# EAGLE schematic HL78xx-STM32U5 -V3 (EAGLE 9.5.2)
Assembly variants: Production

## Sheet 1 of 3
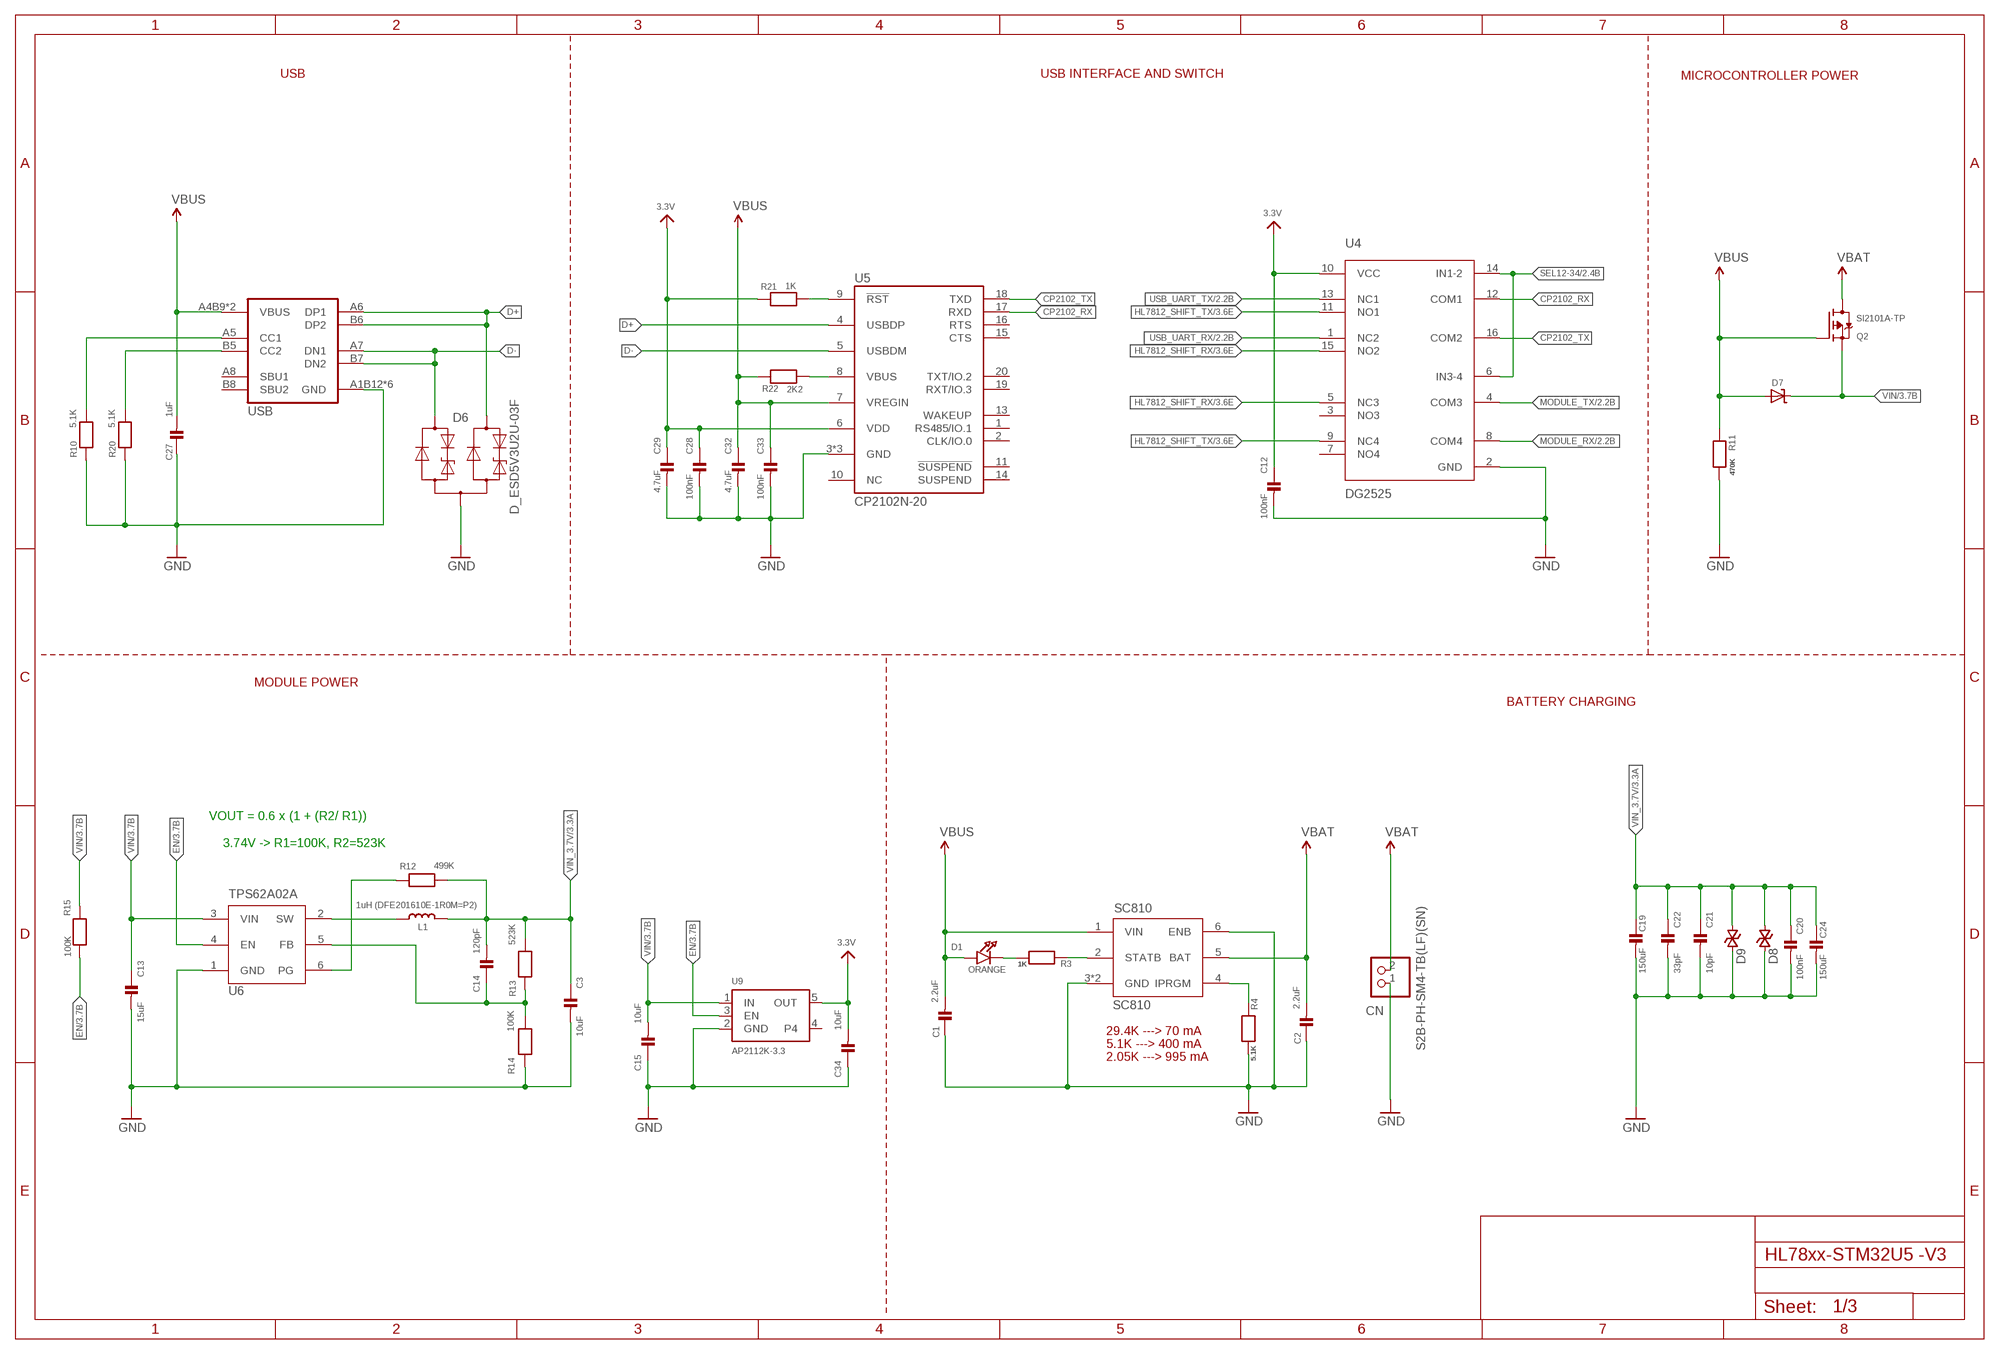
[diagram p0: schematic, sheet 1]

### Parts
C1  2.2uF  CAP_CERAMIC_0402  [_0402]
C2  2.2uF  CAP_CERAMIC_0402  [_0402]
C3  10uF  CAP_CERAMIC1206  [1206]
C12  100nF  CAP_CERAMIC_0402  [_0402]
C13  15uF  CAP_CERAMIC_0805  [_0805]
C14  120pF  CAP_CERAMIC0402  [0402]
C15  10uF  CAP_CERAMIC0603  [0603]
C19  150uF  CAP_CERAMIC-1210  [1210-C]
C20  100nF  CAP_CERAMIC_0402  [_0402]
C21  10pF  CAP_CERAMIC_0402  [_0402]
C22  33pF  CAP_CERAMIC_0402  [_0402]
C24  150uF  CAP_CERAMIC-1210  [1210-C]
C27  1uF  CAP_CERAMIC_0402  [_0402]
C28  100nF  CAP_CERAMIC_0402  [_0402]
C29  4.7uF  CAP_CERAMIC_0402  [_0402]
C32  4.7uF  CAP_CERAMIC_0402  [_0402]
C33  100nF  CAP_CERAMIC_0402  [_0402]
C34  10uF  CAP_CERAMIC0603  [0603]
CN  S2B-PH-SM4-TB(LF)(SN)  JST_2PIN  [JSTPH2]
D1  ORANGE  LED0603  [CHIPLED_0603]
D6  D_ESD5V3U2U-03F  [SOT723]
D7  DIODE-SCHOTTKYSOD-123  [SOD-123]
D8  CGA0402MLC-05G  ESD-0402-0402_ESD  [_0402_ESD]
D9  CGA0402MLC-05G  ESD-0402-0402_ESD  [_0402_ESD]
L1  1uH (DFE201610E-1R0M=P2)  INDUCTOR-0806  [0806-IND]
Q2  SI2101A-TP  MOSFET-P  [SOT23-3]
R3  1K  RESISTOR_0402  [0402-R]
R4  5.1K  RESISTOR_0402  [0402-R]
R10  5.1K  RESISTOR_0402  [0402-R]
R11  470K  RESISTOR_0402  [0402-R]
R12  499K  RESISTOR0603  [0603]
R13  523K  RESISTOR_0603  [_0603-R]
R14  100K  RESISTOR0402  [0402]
R15  100K  RESISTOR0402  [0402]
R20  5.1K  RESISTOR_0402  [0402-R]
R21  1K  RESISTOR_0402  [0402-R]
R22  2K2  RESISTOR_0402  [0402-R]
U1  SC810  [MLPD-UT62X2]
U4  DG2525  [QFN-16L]
U5  CP2102N-20  [QFN20]
U6  TPS62A02A  TPS62A0XA  [SOT-563]
U9  AP2112K-3.3  VREG_SOT23-5  [SOT23-5@1]
USB  USB-4110-CGT  [USB4105-CGT]

### Nets
3.3V: C12.1 C28.1 C29.1 C34.2 R21.2 U4.10(VCC) U5.6(VDD) U9.5(OUT) ; also sheet 2,3
CC1: R10.1 USB.A5(CC1)
CC2: R20.1 USB.B5(CC2)
CP2102_RX: U4.12(COM1) U5.17(RXD)
CP2102_TX: U4.16(COM2) U5.18(TXD)
D+: D6.2(C2) U5.4(USBDP) USB.A6(DP1) USB.B6(DP2)
D-: D6.1(C1) U5.5(USBDM) USB.A7(DN1) USB.B7(DN2)
EN: R15.2 U6.4(EN) U9.3(EN) ; also sheet 3
GND: C1.1 C2.1 C3.2 C12.2 C13.2 C15.1 C19.2 C20.2 C21.2 C22.2 C24.2 C27.1 C28.2 C29.2 C32.2 C33.2 C34.1 CN.1 D6.3(A) D8.1(A) D9.1(A) R4.1 R10.2 R11.1 R14.1 R20.2 U1.3(GND) U1.6(ENB) U1.THERMAL(GND) U4.2(GND) U5.3(GND) U5.12(GND) U5.TP(GND) U6.1(GND) U9.2(GND) USB.A1B12(GND) USB.B1A12(GND) USB.N0(GND) USB.N1(GND) USB.N2(GND) USB.N3(GND) ; also sheet 2,3
HL7812_SHIFT_RX: U4.5(NC3) U4.15(NO2) ; also sheet 3
HL7812_SHIFT_TX: U4.9(NC4) U4.11(NO1) ; also sheet 3
MODULE_RX: U4.8(COM4) ; also sheet 2
MODULE_TX: U4.4(COM3) ; also sheet 2
N$1: D1.C R3.1
N$3: C14.1 R13.1 R14.2 U6.5(FB)
N$5: R12.1 U6.6(PG)
N$8: L1.1 U6.2(SW)
N$28: R22.1 U5.8(VBUS)
N$48: R3.2 U1.2(STATB)
N$51: R4.2 U1.4(IPRGM)
RESET: R21.1 U5.9(!RST)
SEL12-34: U4.6(IN3-4) U4.14(IN1-2) ; also sheet 2
USB_UART_RX: U4.1(NC2) ; also sheet 2
USB_UART_TX: U4.13(NC1) ; also sheet 2
VBAT: C2.2 CN.2 Q2.3(D) U1.5(BAT) ; also sheet 3
VBUS: C1.2 C27.2 C32.1 C33.1 D1.A D7.A Q2.1(G) R11.2 R22.2 U1.1(VIN) U5.7(VREGIN) USB.A4B9(VBUS) USB.B4A9(VBUS) ; also sheet 3
VIN: C13.1 C15.2 D7.C Q2.2(S) R15.1 U6.3(VIN) U9.1(IN) ; also sheet 3
VIN_3.7V: C3.1 C14.2 C19.1 C20.1 C21.1 C22.1 C24.1 D8.2(C) D9.2(C) L1.2 R12.2 R13.2 ; also sheet 3
Unconnected: U4.3(NO3) U4.7(NO4) U5.1(RS485/IO.1) U5.2(CLK/IO.0) U5.11(!SUSPEND) U5.13(WAKEUP) U5.14(SUSPEND) U5.15(CTS) U5.16(RTS) U5.19(RXT/IO.3) U5.20(TXT/IO.2) U9.4 USB.A8(SBU1) USB.B8(SBU2)

### Notes on the sheet
- USB | USB INTERFACE AND SWITCH
- MICROCONTROLLER POWER
- MODULE POWER
- BATTERY CHARGING
- VOUT = 0.6 x (1 + (R2/ R1))
       
      3.74V -> R1=100K, R2=523K
- 29.4K ---> 70 mA
- 5.1K ---> 400 mA
- 2.05K ---> 995 mA

## Sheet 2 of 3
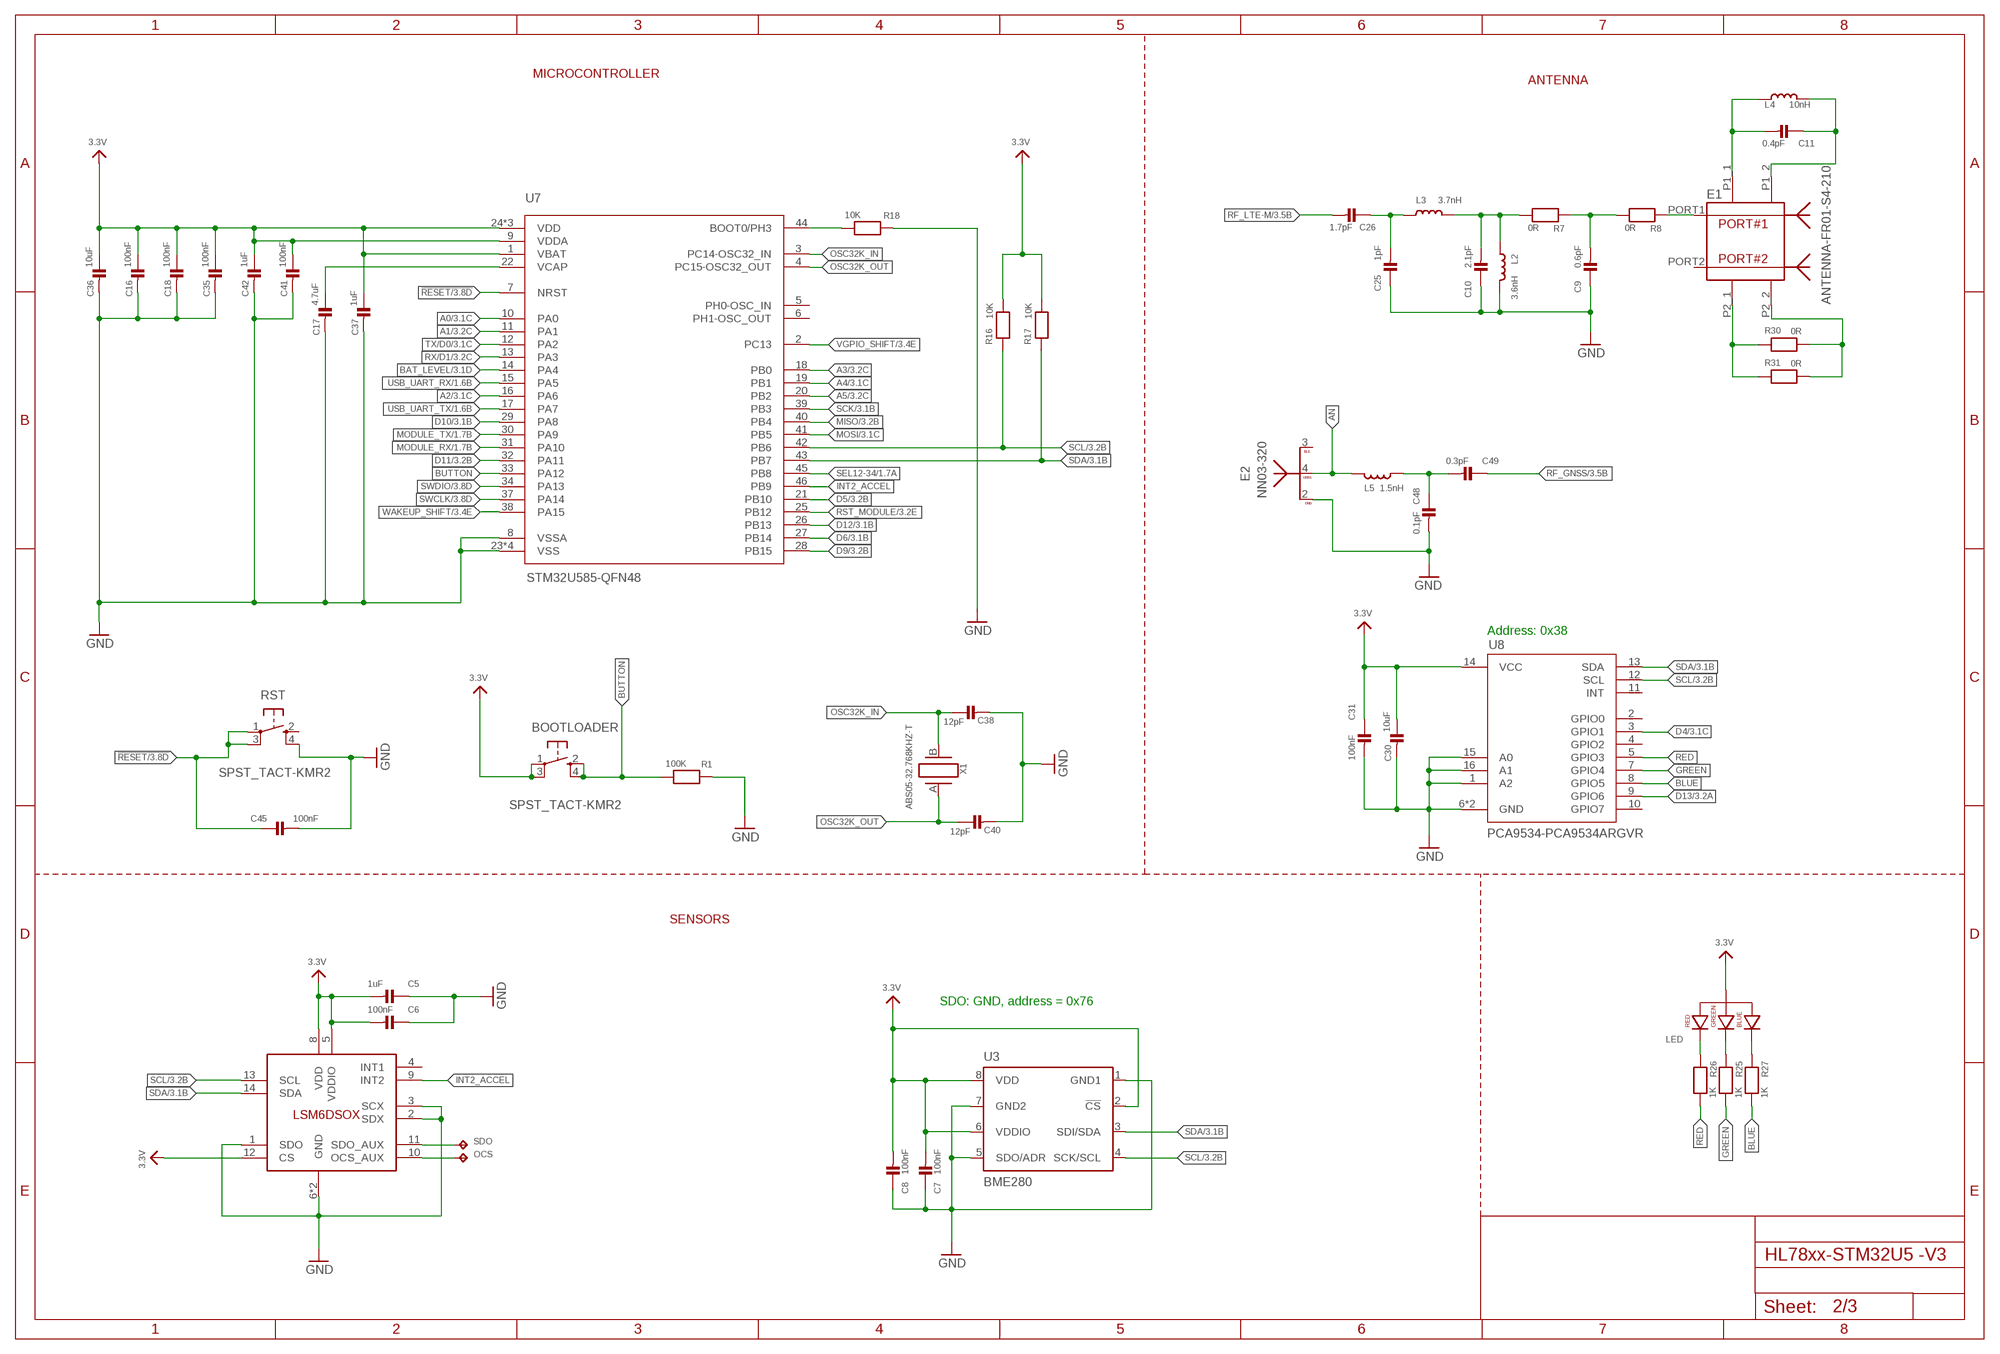
[diagram p1: schematic, sheet 2]

### Parts
BOOTLOADER  SPST_TACT-KMR2  [KMR2]
C5  1uF  CAP_CERAMIC_0402  [_0402]
C6  100nF  CAP_CERAMIC_0402  [_0402]
C7  100nF  CAP_CERAMIC_0402  [_0402]
C8  100nF  CAP_CERAMIC_0402  [_0402]
C9  0.6pF  CAP_CERAMIC_1MMX1MM  [C_1MMX1MM-IGNION]
C10  2.1pF  CAP_CERAMIC_1MMX1MM  [C_1MMX1MM-IGNION]
C11  0.4pF  CAP_CERAMIC-1MMX0.75MM-IGNION  [C_1MMX0.75MM-IGNION]
C16  100nF  CAP_CERAMIC_0402  [_0402]
C17  4.7uF  CAP_CERAMIC_0402  [_0402]
C18  100nF  CAP_CERAMIC_0402  [_0402]
C25  1pF  CAP_CERAMIC_1MMX1MM  [C_1MMX1MM-IGNION]
C26  1.7pF  CAP_CERAMIC_1MMX1MM  [C_1MMX1MM-IGNION]
C30  10uF  CAP_CERAMIC_0402  [_0402]
C31  100nF  CAP_CERAMIC_0402  [_0402]
C35  100nF  CAP_CERAMIC_0402  [_0402]
C36  10uF  CAP_CERAMIC_0402  [_0402]
C37  1uF  CAP_CERAMIC_0402  [_0402]
C38  12pF  CAP_CERAMIC_0402  [_0402]
C40  12pF  CAP_CERAMIC_0402  [_0402]
C41  100nF  CAP_CERAMIC_0402  [_0402]
C42  1uF  CAP_CERAMIC_0402  [_0402]
C45  100nF  CAP_CERAMIC_0402  [_0402]
C48  0.1pF  CAP_CERAMIC_1MMX1MM  [C_1MMX1MM-IGNION]
C49  0.3pF  CAP_CERAMIC_1MMX1MM  [C_1MMX1MM-IGNION]
E1  ANTENNA-FR01-S4-210  [XDCR_FR01-S4-210]
E2  NN03-320  [XCVR_NN03-320]
L2  3.6nH  INDUCTOR_1MMX1MM-IGNION  [L_1MMX1MM-IGNION]
L3  3.7nH  INDUCTOR_1MMX1MM-IGNION  [L_1MMX1MM-IGNION]
L4  10nH  INDUCTOR-L_1MMX0.75MM-IGNION  [L_1MMX0.75MM-IGNION]
L5  1.5nH  INDUCTOR_1MMX1MM-IGNION  [L_1MMX1MM-IGNION]
LED  LED-RGB-ANODE-3.5X2.8-WURTH-150044M155260  [LED-WURTH-150044M155260]
OCS  TP-1SIDE-1P0  [TP-1P0]
R1  100K  RESISTOR_0402  [0402-R]
R7  0R  RESISTOR_1MMX1MM  [R_1MMX1MM-IGNION]
R8  0R  RESISTOR_1MMX1MM  [R_1MMX1MM-IGNION]
R16  10K  RESISTOR_0402  [0402-R]
R17  10K  RESISTOR_0402  [0402-R]
R18  10K  RESISTOR_0402  [0402-R]
R25  1K  RESISTOR_0402  [0402-R]
R26  1K  RESISTOR_0402  [0402-R]
R27  1K  RESISTOR_0402  [0402-R]
R30  0R  RESISTOR-1MMX0.75MM-IGNION  [R_1MMX0.75MM-IGNION]
R31  0R  RESISTOR-1MMX0.75MM-IGNION  [R_1MMX0.75MM-IGNION]
RST  SPST_TACT-KMR2  [KMR2]
SDO  TP-1SIDE-1P0  [TP-1P0]
U2  LSM6DSOX  [LGA-14L]
U3  BME280  [BME280_LGA]
U7  STM32U585-QFN48  [TQFN48_7MM]
U8  PCA9534-PCA9534ARGVR  [QFN16-4X4MM]
X1  ABS05-32.768KHZ-T  ABS05-32.768KHZ-9-T  [ABS05]

### Nets
3.3V: BOOTLOADER.1(P) BOOTLOADER.3(P1) C5.2 C6.2 C7.2 C8.2 C16.1 C18.1 C30.1 C31.1 C35.1 C36.1 C37.1 C41.1 C42.1 LED.1(ANODE) R16.2 R17.2 U2.5(VDDIO) U2.8(VDD) U2.12(CS) U3.2(!CS) U3.6(VDDIO) U3.8(VDD) U7.1(VBAT) U7.9(VDDA) U7.24(VDD) U7.36(VDD) U7.48(VDD) U8.14(VCC) ; also sheet 1,3
!RESET: C45.1 RST.1(P) RST.3(P1) U7.7(NRST) ; also sheet 3
A0: U7.10(PA0) ; also sheet 3
A1: U7.11(PA1) ; also sheet 3
A2: U7.16(PA6) ; also sheet 3
A3: U7.18(PB0) ; also sheet 3
A4: U7.19(PB1) ; also sheet 3
A5: U7.20(PB2) ; also sheet 3
AN: E2.4(FEED_GNSS) L5.1
BAT_LEVEL: U7.14(PA4) ; also sheet 3
BLUE: R27.2 U8.8(GPIO5)
BOOT: R18.2 U7.44(BOOT0/PH3)
BUTTON: BOOTLOADER.2(S) BOOTLOADER.4(S1) R1.2 U7.33(PA12)
D4: U8.3(GPIO1) ; also sheet 3
D5: U7.21(PB10) ; also sheet 3
D6: U7.27(PB14) ; also sheet 3
D9: U7.28(PB15) ; also sheet 3
D10: U7.29(PA8) ; also sheet 3
D11: U7.32(PA11) ; also sheet 3
D12: U7.26(PB13) ; also sheet 3
D13: U8.9(GPIO6) ; also sheet 3
GND: C5.1 C6.1 C7.1 C8.1 C9.1 C10.1 C16.2 C17.2 C18.2 C25.1 C30.2 C31.2 C35.2 C36.2 C37.2 C38.2 C40.2 C41.2 C42.2 C45.2 C48.2 E2.2(GROUND) L2.2 R1.1 R18.1 RST.4(S1) U2.1(SDO) U2.2(SDX) U2.3(SCX) U2.6(GND) U2.7(GND) U3.1(GND1) U3.5(SDO/ADR) U3.7(GND2) U7.8(VSSA) U7.23(VSS) U7.35(VSS) U7.47(VSS) U7.THERMAL(VSS) U8.1(A2) U8.6(GND) U8.15(A0) U8.16(A1) U8.T(GND) ; also sheet 1,3
GREEN: R25.2 U8.7(GPIO4)
INT2_ACCEL: U2.9(INT2) U7.46(PB9)
MISO: U7.40(PB4) ; also sheet 3
MODULE_RX: U7.31(PA10) ; also sheet 1
MODULE_TX: U7.30(PA9) ; also sheet 1
MOSI: U7.41(PB5) ; also sheet 3
N$4: C17.1 U7.22(VCAP)
N$19: LED.4(BLUE_CATHODE) R27.1
N$20: C48.1 C49.2 L5.2
N$21: E1.PORT1(PORT#1) R8.1
N$22: C10.2 L2.1 L3.2 R7.2
N$23: C9.2 R7.1 R8.2
N$24: C25.2 C26.1 L3.1
N$25: C11.2 E1.P1_1(SECTION1_1) L4.1
N$26: C11.1 E1.P1_2(SECTION1_2) L4.2
N$27: LED.3(GREEN_CATHODE) R25.1
N$29: E1.P2_1(SECTION2_1) R30.1 R31.1
N$30: LED.2(RED_CATHODE) R26.1
N$31: E1.P2_2(SECTION2_2) R30.2 R31.2
OCS_AUX: OCS.TP U2.10(OCS_AUX)
OSC32K_IN: C38.1 U7.3(PC14-OSC32_IN) X1.B
OSC32K_OUT: C40.1 U7.4(PC15-OSC32_OUT) X1.A
RED: R26.2 U8.5(GPIO3)
RF_GNSS: C49.1 ; also sheet 3
RF_LTE-M: C26.2 ; also sheet 3
RST_MODULE: U7.25(PB12) ; also sheet 3
RX/D1: U7.13(PA3) ; also sheet 3
SCK: U7.39(PB3) ; also sheet 3
SCL: R16.1 U2.13(SCL) U3.4(SCK/SCL) U7.42(PB6) U8.12(SCL) ; also sheet 3
SDA: R17.1 U2.14(SDA) U3.3(SDI/SDA) U7.43(PB7) U8.13(SDA) ; also sheet 3
SDO_AUX: SDO.TP U2.11(SDO_AUX)
SEL12-34: U7.45(PB8) ; also sheet 1
SWCLK: U7.37(PA14) ; also sheet 3
SWDIO: U7.34(PA13) ; also sheet 3
TX/D0: U7.12(PA2) ; also sheet 3
USB_UART_RX: U7.15(PA5) ; also sheet 1
USB_UART_TX: U7.17(PA7) ; also sheet 1
VGPIO_SHIFT: U7.2(PC13) ; also sheet 3
WAKEUP_SHIFT: U7.38(PA15) ; also sheet 3
Unconnected: E1.PORT2(PORT#2) E2.3(FEED_BLUETOOTH) RST.2(S) U2.4(INT1) U7.5(PH0-OSC_IN) U7.6(PH1-OSC_OUT) U8.2(GPIO0) U8.4(GPIO2) U8.10(GPIO7) U8.11(INT)

### Notes on the sheet
- MICROCONTROLLER
- ANTENNA
- Address: 0x38
- SENSORS
- SDO: GND, address = 0x76

## Sheet 3 of 3
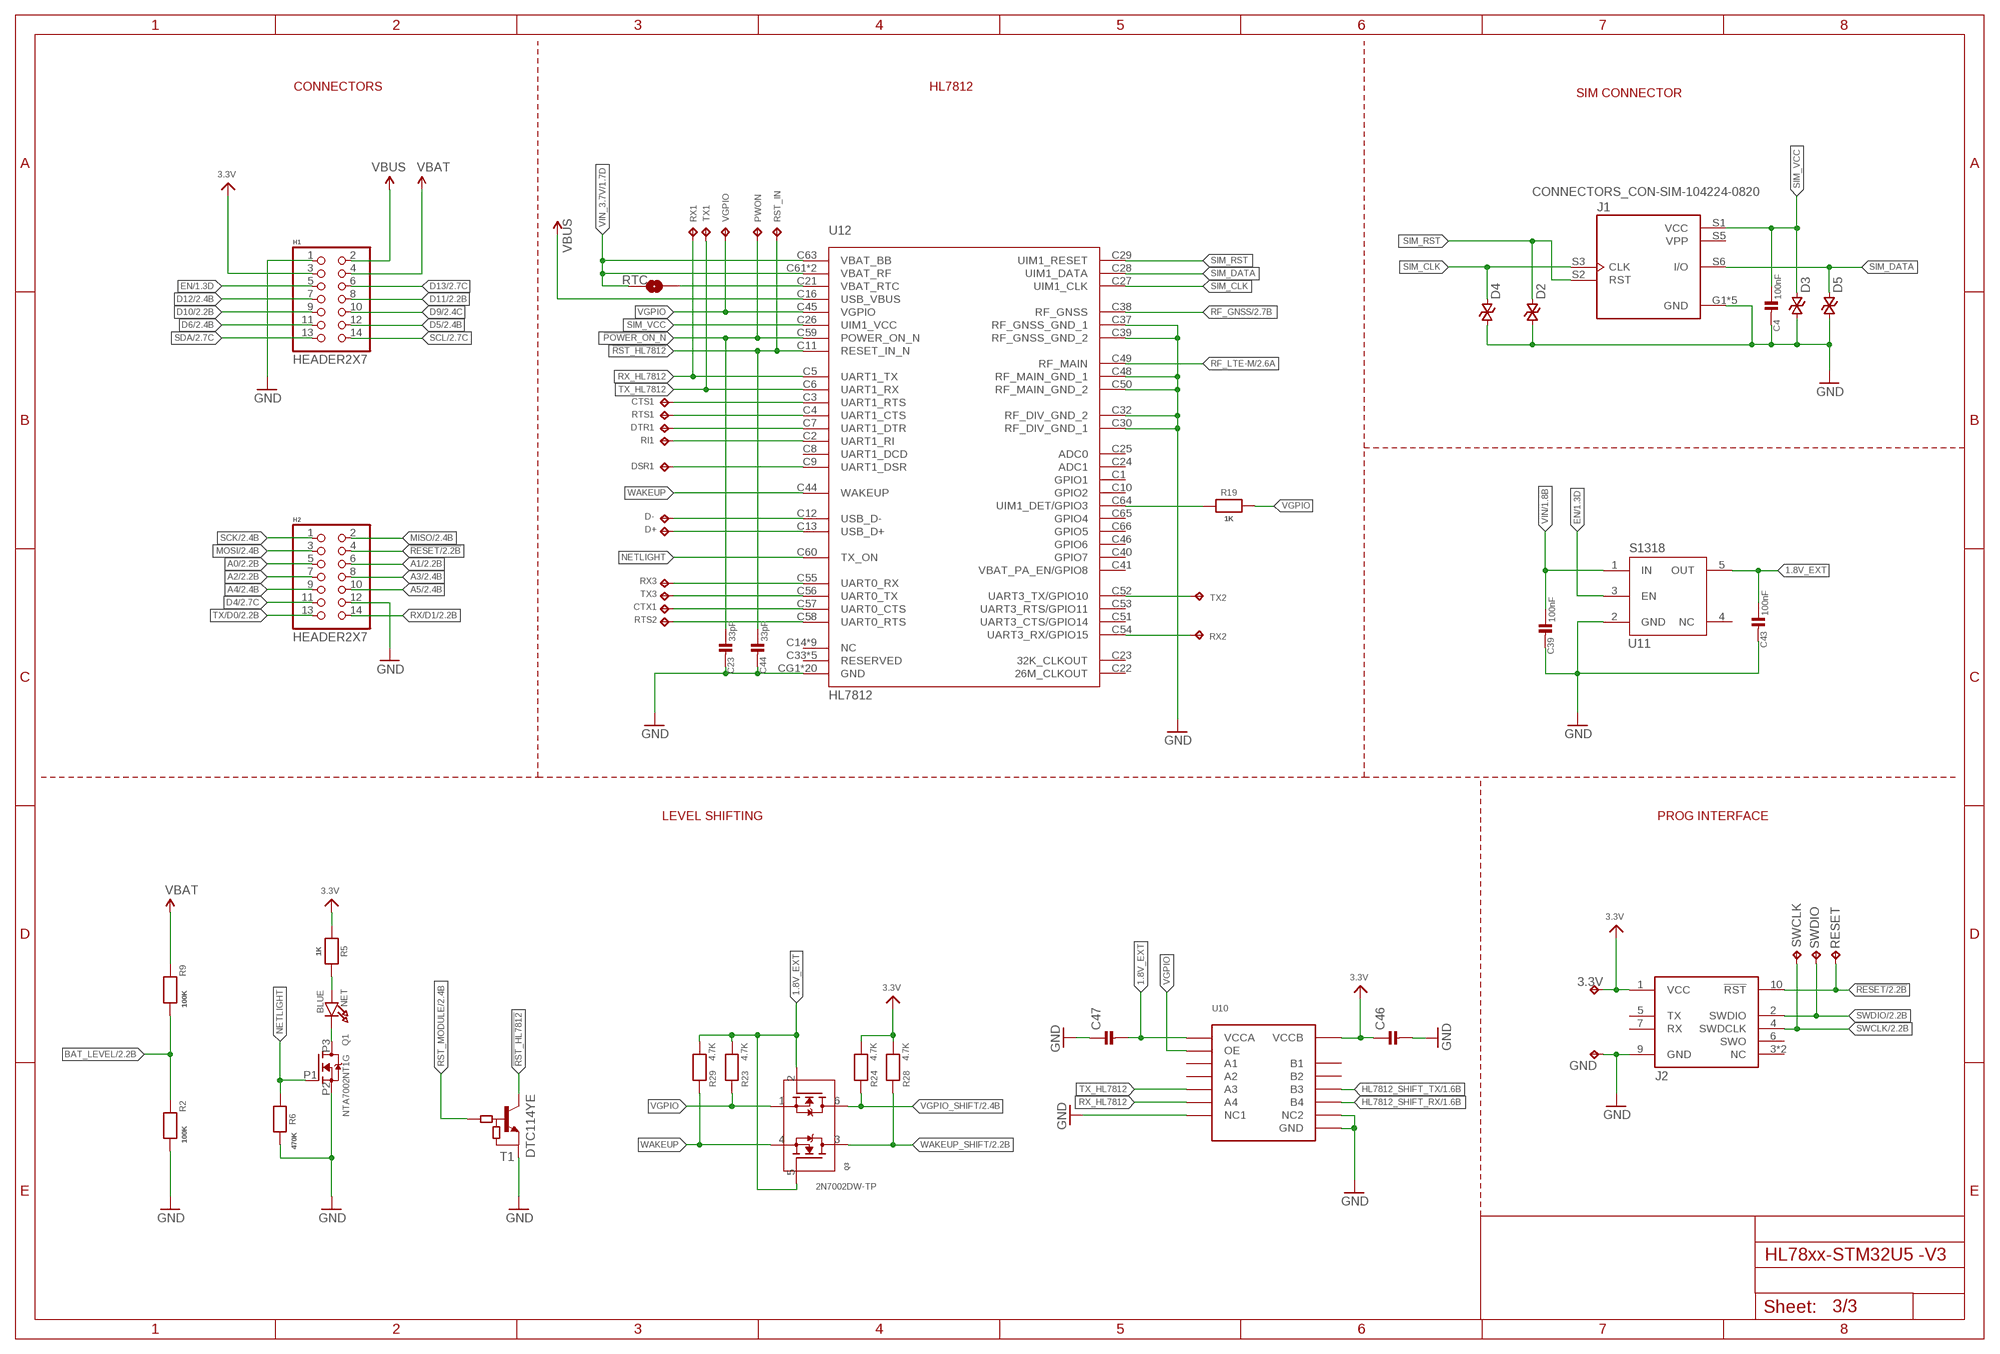
[diagram p2: schematic, sheet 3]

### Parts
3.3V  TP-1SIDE-1P0  [TP-1P0]
C4  100nF  CAP_CERAMIC_0402  [_0402]
C23  33pF  CAP_CERAMIC_0402  [_0402]
C39  100nF  CAP_CERAMIC_0402  [_0402]
C43  100nF  CAP_CERAMIC_0402  [_0402]
C44  33pF  CAP_CERAMIC_0402  [_0402]
C46  100nF  CAP_CERAMIC_0402  [_0402]
C47  100nF  CAP_CERAMIC_0402  [_0402]
CTS1  TP-1SIDE-1P0  [TP-1P0]
CTX1  TP-1SIDE-1P0  [TP-1P0]
D2  CGA0402MLC-05G  ESD-0402-0402_ESD  [_0402_ESD]
D3  CGA0402MLC-05G  ESD-0402-0402_ESD  [_0402_ESD]
D4  CGA0402MLC-05G  ESD-0402-0402_ESD  [_0402_ESD]
D5  CGA0402MLC-05G  ESD-0402-0402_ESD  [_0402_ESD]
D+  TP-1SIDE-1P0  [TP-1P0]
D-  TP-1SIDE-1P0  [TP-1P0]
DSR1  TP-1SIDE-1P0  [TP-1P0]
DTR1  TP-1SIDE-1P0  [TP-1P0]
GND  TP-1SIDE-1P0  [TP-1P0]
H1  HEADER2X7  [2X7-HEADER]
H2  HEADER2X7  [2X7-HEADER]
J1  CONNECTORS_CON-SIM-104224-0820  [CONNECTORS_MOLEX_104224-0820]
J2  CON-FTSH-105-XX-X-DV  [SAMTEC_FTSH-105-XX-X-DV]
NET  BLUE  LED0603  [CHIPLED_0603]
PWON  TP-1SIDE-1P0  [TP-1P0]
Q1  NTA7002NT1G  MOSFET-N-SC75  [SC-75/SOT-416]
Q3  2N7002DW-TP  MOSFET-N-DUAL  [SOT363]
R2  100K  RESISTOR_0402  [0402-R]
R5  1K  RESISTOR_0402  [0402-R]
R6  470K  RESISTOR_0402  [0402-R]
R9  100K  RESISTOR_0402  [0402-R]
R19  1K  RESISTOR_0402  [0402-R]
R23  4.7K  RESISTOR_0402  [0402-R]
R24  4.7K  RESISTOR_0402  [0402-R]
R28  4.7K  RESISTOR_0402  [0402-R]
R29  4.7K  RESISTOR_0402  [0402-R]
RESET  TP-1SIDE-1P0  [TP-1P0]
RI1  TP-1SIDE-1P0  [TP-1P0]
RST_IN  TP-1SIDE-1P0  [TP-1P0]
RTC  JUMPER-SMT_2_NC_PASTE_SILK  [SMT-JUMPER_2_NC_PASTE_SILK]
RTS1  TP-1SIDE-1P0  [TP-1P0]
RTS2  TP-1SIDE-1P0  [TP-1P0]
RX1  TP-1SIDE-1P0  [TP-1P0]
RX2  TP-1SIDE-1P0  [TP-1P0]
RX3  TP-1SIDE-1P0  [TP-1P0]
SWCLK  TP-1SIDE-1P0  [TP-1P0]
SWDIO  TP-1SIDE-1P0  [TP-1P0]
T1  DTC114YE  [SC-75/SOT-416]
TX1  TP-1SIDE-1P0  [TP-1P0]
TX2  TP-1SIDE-1P0  [TP-1P0]
TX3  TP-1SIDE-1P0  [TP-1P0]
U10  TXB0104  [PVQFN-N14]
U11  S1318  [SOT23-5]
U12  HL7812  HL781X  [HL781X]
VGPIO  TP-1SIDE-1P0  [TP-1P0]

### Nets
1.8V_EXT: C43.1 C47.2 Q3.2(G1) Q3.5(G2) R23.2 R29.2 U10.1(VCCA) U11.5(OUT)
3.3V: 3.3V.TP C46.1 H1.3 J2.1(VCC) R5.1 R24.2 R28.2 U10.14(VCCB) ; also sheet 1,2
!POWER_ON_N: C23.1 PWON.TP U12.C59(POWER_ON_N)
!RESET: H2.4 J2.10(!RST) RESET.TP ; also sheet 2
!RST_HL7812: C44.1 RST_IN.TP T1.P3(C) U12.C11(RESET_IN_N)
A0: H2.5 ; also sheet 2
A1: H2.6 ; also sheet 2
A2: H2.7 ; also sheet 2
A3: H2.8 ; also sheet 2
A4: H2.9 ; also sheet 2
A5: H2.10 ; also sheet 2
BAT_LEVEL: R2.1 R9.2 ; also sheet 2
CTS_HL7812: CTS1.TP U12.C3(UART1_RTS)
D4: H2.11 ; also sheet 2
D5: H1.12 ; also sheet 2
D6: H1.11 ; also sheet 2
D9: H1.10 ; also sheet 2
D10: H1.9 ; also sheet 2
D11: H1.8 ; also sheet 2
D12: H1.7 ; also sheet 2
D13: H1.6 ; also sheet 2
EN: H1.5 U11.3(EN) ; also sheet 1
GND: C4.2 C23.2 C39.2 C43.2 C44.2 C46.2 C47.1 D2.1(A) D3.1(A) D4.1(A) D5.1(A) GND.TP H1.1 H2.12 J1.G1(GND) J1.G2(GND) J1.G3(GND) J1.G4(GND) J1.S4(GND) J2.9(GND) Q1.P2(S) R2.2 R6.2 T1.P2(E) U10.6(NC1) U10.7(GND) U10.9(NC2) U10.GND U11.2(GND) U12.C30(RF_DIV_GND_1) U12.C32(RF_DIV_GND_2) U12.C37(RF_GNSS_GND_1) U12.C39(RF_GNSS_GND_2) U12.C48(RF_MAIN_GND_1) U12.C50(RF_MAIN_GND_2) U12.CG1(GND) U12.CG2(GND) U12.CG3(GND) U12.CG4(GND) U12.G1(GND) U12.G2(GND) U12.G3(GND) U12.G4(GND) U12.G5(GND) U12.G6(GND) U12.G7(GND) U12.G8(GND) U12.G9(GND) U12.G10(GND) U12.G11(GND) U12.G12(GND) U12.G13(GND) U12.G14(GND) U12.G15(GND) U12.G16(GND) ; also sheet 1,2
HL7812_SHIFT_RX: U10.10(B4) ; also sheet 1
HL7812_SHIFT_TX: U10.11(B3) ; also sheet 1
HL_D+: D-.TP U12.C12(USB_D-)
HL_D-: D+.TP U12.C13(USB_D+)
MISO: H2.2 ; also sheet 2
MOSI: H2.3 ; also sheet 2
N$7: NET.C Q1.P3(D)
N$9: NET.A R5.2
N$12: RX2.TP U12.C54(UART3_RX/GPIO15)
N$14: TX2.TP U12.C52(UART3_TX/GPIO10)
N$15: RX3.TP U12.C55(UART0_RX)
N$16: TX3.TP U12.C56(UART0_TX)
N$17: CTX1.TP U12.C57(UART0_CTS)
N$18: RTS2.TP U12.C58(UART0_RTS)
N$32: RI1.TP U12.C2(UART1_RI)
N$33: DTR1.TP U12.C7(UART1_DTR)
N$34: DSR1.TP U12.C9(UART1_DSR)
N$37: RTC.2 U12.C21(VBAT_RTC)
NETLIGHT: Q1.P1(G) R6.1 U12.C60(TX_ON)
RF_GNSS: U12.C38(RF_GNSS) ; also sheet 2
RF_LTE-M: U12.C49(RF_MAIN) ; also sheet 2
RST_MODULE: T1.P1(B) ; also sheet 2
RTS_HL7812: RTS1.TP U12.C4(UART1_CTS)
RX/D1: H2.14 ; also sheet 2
RX_HL7812: RX1.TP U10.5(A4) U12.C5(UART1_TX)
SCK: H2.1 ; also sheet 2
SCL: H1.14 ; also sheet 2
SDA: H1.13 ; also sheet 2
SIM_CLK: D4.2(C) J1.S3(CLK) U12.C27(UIM1_CLK)
SIM_DATA: D5.2(C) J1.S6(I/O) U12.C28(UIM1_DATA)
SIM_RST: D2.2(C) J1.S2(RST) U12.C29(UIM1_RESET)
SIM_VCC: C4.1 D3.2(C) J1.S1(VCC) U12.C26(UIM1_VCC)
SWCLK: J2.4(SWDCLK) SWCLK.TP ; also sheet 2
SWDIO: J2.2(SWDIO) SWDIO.TP ; also sheet 2
TX/D0: H2.13 ; also sheet 2
TX_HL7812: TX1.TP U10.4(A3) U12.C6(UART1_RX)
UIM1_DET: R19.1 U12.C64(UIM1_DET/GPIO3)
VBAT: H1.4 R9.1 ; also sheet 1
VBUS: H1.2 U12.C16(USB_VBUS) ; also sheet 1
VGPIO: Q3.1(S1) R19.2 R23.1 U10.8(OE) U12.C45(VGPIO) VGPIO.TP
VGPIO_SHIFT: Q3.6(D1) R24.1 ; also sheet 2
VIN: C39.1 U11.1(IN) ; also sheet 1
VIN_3.7V: RTC.1 U12.C61(VBAT_RF) U12.C62(VBAT_RF) U12.C63(VBAT_BB) ; also sheet 1
WAKEUP: Q3.4(S2) R29.1 U12.C44(WAKEUP)
WAKEUP_SHIFT: Q3.3(D2) R28.1 ; also sheet 2
Unconnected: J2.3(NC) J2.5(TX) J2.6(SWO) J2.7(RX) J2.8(NC) U10.2(A1) U10.3(A2) U10.12(B2) U10.13(B1) U11.4(NC) U12.C1(GPIO1) U12.C8(UART1_DCD) U12.C10(GPIO2) U12.C14(NC) U12.C15(NC) U12.C17(NC) U12.C18(NC) U12.C19(NC) U12.C20(NC) U12.C22(26M_CLKOUT) U12.C23(32K_CLKOUT) U12.C24(ADC1) U12.C25(ADC0) U12.C31(NC) U12.C33(RESERVED) U12.C34(RESERVED) U12.C35(RESERVED) U12.C36(RESERVED) U12.C40(GPIO7) U12.C41(VBAT_PA_EN/GPIO8) U12.C42(NC) U12.C43(RESERVED) U12.C46(GPIO6) U12.C47(NC) U12.C51(UART3_CTS/GPIO14) U12.C53(UART3_RTS/GPIO11) U12.C65(GPIO4) U12.C66(GPIO5)

### Notes on the sheet
- CONNECTORS | HL7812
- SIM CONNECTOR
- LEVEL SHIFTING | PROG INTERFACE

## Power pins joined to a net without a drawn wire
NC: U5.10(NC)
VPP: J1.S5(VPP)

## Library data of the parts
3.3V CTS1 CTX1 D+ D- DSR1 DTR1 GND OCS PWON RESET RI1 RST_IN RTS1 RTS2 RX1-RX3 SDO SWCLK SWDIO TX1-TX3 VGPIO = tobias:TP: TEST POINT
BOOTLOADER RST = tobias:SPST_TACT: SMT 6mm switch, EVQQ2 series http://www.ladyada.net/library/eagle
C1-C49 = tobias:CAP_CERAMIC: Ceramic Capacitors 0402 - 0402 Surface Mount Capacitors 16pF 50V 5% [Digikey: 445-4899-2-ND] 18pF 50V 5% [Digikey: 490-1281-2-ND] 22pF 50V 5% [Digikey: 490-1283-2-ND] 68pF 50V 5% [Digikey: 490-1289-2-ND] 0.1uF 10V 10% [Digikey: 490-1318-2-ND] 1.0uF 6.3V 10% [Digikey: 490-1320-2-ND] 0603 - 0603 Surface Mount Capacitors 16 pF 50V 5% [Digikey: 445-5051-2-ND] 22 pF 50V [Digikey: PCC220ACVTR-ND] 33 pF 50V 5% [Digikey: 490-1415-1-ND] 56pF 50V 5% [Digikey: 490-1421-1-ND] 220pF 50V 5% [Digikey: 445-1285-1-ND] 680 pF 50V 2200 pF 50V 5% C0G [Digikey: 445-1297-1-ND] 5600 pF 100V 5% X7R [Digikey: 478-3711-1-ND] 0.1 µF 25V 10% [Digikey: PCC2277TR-ND] 0.22 µF 16V 10% X7R [Digikey: 445-1318-1-ND] 1.0 µF 25V 10% [Digikey: 445-5146-2-ND] 0603 - RF Specific 3pF 250V +/-0.1pF RF [Digikey: 712-1347-1-ND] 18 pF 250V 5% [Digikey: 478-3505-1-ND or 712-1322-1-ND] 56 pF 250V 5% C0G RF [Digikey: 490-4867-1-ND] 68 pF 250V RF [Digikey: 490-4868-1-ND] 0805 - 0805 Surface Mount Capacitors 220 pF 250V 2% RF Ceramic Capacitor [Digikey: 712-1398-1-ND] 1000 pF 50V 2% NP0 Ceramic Capacitor [Digikey: 478-3760-1-ND] 0.1 µF 25V 10% Ceramic Capacitor [Digikey: PCC1828TR-ND] 1.0 µF 16V 10% Ceramic Capacitor[Digikey: 490-1691-2-ND] 10.0 µF 10V 10% Ceramic Capacitor[Digikey: 709-1228-1-ND] 10.0 uF 16V 10% Ceramic Capacitor [Digikey: 478-5165-2-ND] 47 uF 6.3V 20% Ceramic Capacitor [Digikey: 587-1779-1-ND or 399-5506-1-ND] 1206 - 1206 Surface Mount Capacitors 47uF 10V 20% Ceramic Capacitor [Digikey: 490-5528-1-ND or 399-5508-1-ND or 445-6010-1-ND] 100uF 6.3V -20%, +80% Y5V Ceramic Capacitor (Digikey: 490-4512-1-ND, Mouser: 81-GRM31CF50J107ZE1L)
CN = tobias:JST_2PIN: JST 2-Pin Right-Angle Connector PH-Series - 4UConnector: 17311 SH-Series - 4UConnector: 07278
D1 NET = tobias:LED: LED 0603 - 0603 Surface Mount Package 2mA: Green LED - Low Power (3.9mcd, 2ma, 1.7Vf) - Digikey: 475-2709-2-ND Orange LED - Low Power (9.8mcd, 2ma, 1.8Vf) - Digikey: 475-1194-2-ND Red LED - Low Power (5mcd, 2ma, 1.8Vf) - Digikey: 475-1195-2-ND Yellow LED - Low Power (7mcd, 2ma, 1.8Vf) - Digikey: 475-1196-2-ND 5mA: Blue LED - Low Power (17mcd, 5ma, 2.9Vf) - Digikey: LNJ937W8CRACT-ND 0805 - 0805 Surface Mount Package 2mA: Red LED (8.8mcd, 2mA, 1.8Vf, Clear) - Low Power [Digikey: 475-2510-1-ND] Green LED (5mcd, 2mA, 1.8Vf, Clear) - Low Power [Digikey: 475-2730-1-ND] Yellow LED (11.3mcd, 2mA, 1.8Vf, Clear) - Low Power [Digikey: 475-2555-1-ND] 20mA: Red LED (104mcd, 20mA, Diffused) - LS R976 [Digikey: 475-1278-6-ND] Red LED (12mcd, 20mA, 2.0Vf, Clear) - APT2012EC [Digikey: 754-1128-1-ND] Green LED (15mcd, 20mA, 2.2Vf, Clear) - APT2012GC [Digikey: 754-1131-1-ND] Orange LED (160mcd, 20mA, 2.1Vf, Clear) - APT2012SECK [Digikey: 754-1130-1-ND] 1206 - 1206 Surface Mount Package Green LED (26mcd, 20mA, Diffused) - LG N971 [Digikey: 475-1407-6-ND] Red LED (15mcd, 20mA, Diffused) - LH N974 [Digikey: 475-1416-6-ND]
D2-D5 D8 D9 = tobias:ESD-0402
D6 = tobias:D_ESD5V3U2U: ESD5V3U2U TVS Diode (Uni-directional Ultra Low ESD) Vrwm=5.3V, 0.4pF@1MHz; DIGIKEY: ESD5V3U2U-03F H6327DKR-ND
D7 = tobias:DIODE-SCHOTTKY
E1 = tobias:ANTENNA-FR01-S4-210; DESCRIPTION: 700MHz, 800MHz, 850MHz, 900MHz, 1.7GHz, 1.8GHz, 1.9GHz, 2GHz, 2.1GHz, 2.3GHz, 2.5GHz, 2.6GHz, 1.561GHz, 1.575GHz, 1.606GHz, 2.45GHz, 3.5GHz, 3.7GHz, 3.8GHz 5G, DCS, GNSS, GSM, LTE, PCS, UMTS Chip RF Antenna 698MHz ~ 3.8GHz 2.4dBi Solder Surface Mount; MF: Ignion; MP: FR01-S4-210; PACKAGE: None
E2 = tobias:NN03-320: 1.561GHz, 1.575GHz, 1.602GHz Beidou, Galileo, GLONASS, GNSS, GPS Chip RF Antenna 1.598GHz ~ 1.606GHz 1.6dBi, 1.8dBi, 1.1dBi Solder Surface Mount; DESCRIPTION: Dual port antenna booster for GNSS, Bluetooth, 5G and UWB (1561 - 1606MHz, 2400 - 2500MHz, 3400 - 3800MHz, 3100 - 4800MHz and 6000 - 10600 MHz), signal booster; DIGI-KEY_PART_NUMBER: 2115-NN03-320TR-ND; MF: Ignion; MP: NN03-320; PACKAGE: None; PURCHASE-URL: https://pricing.snapeda.com/search/part/NN03-320/?ref=eda
H1 H2 = tobias:HEADER2X7
J1 = tobias:CONNECTORS_CON-SIM: Conn SIM SKT 6 POS 2.54mm Solder RA SMD; DESC: NANOSIM SOCKET 1.11H P/PULL TYPE; DESCRIPTION: 6 Position Card Connector NANO SIM Surface Mount, Right Angle Gold; MF: Molex; MPN: 104224-0820; PACKAGE: None; PRICE: None; PROD_ID: CONN-15682
J2 = tobias:CON-FTSH-105-XX-X-DV: Connector Header Surface Mount 10 position 0.050" (1.27mm) Check prices <https://pricing.snapeda.com/parts/FTSH-105-01-F-DV-K/Samtec/view-part?ref=eda>; DESCRIPTION: Connector Header Surface Mount 10 position 0.050 (1.27mm); DIGIKEYPN: SAM8796-ND; MF: Samtec; MPN: FTSH-105-01-F-DV-K; PRICE: None; PROD_ID: CONN-15353; PURCHASE-URL: https://pricing.snapeda.com/search/part/FTSH-105-01-F-DV-K/?ref=eda
L1-L5 = tobias:INDUCTOR: Inductors 0603: 10nH Ceramic Inductor - microwire antenna/RF (Digikey: 712-1434-2-ND) 0805: 560nH Ceramic Inductor - RF (Digikey: 553-1047-1-ND) 270nH Ceramic Inductor - Q = 40@250MHz, +-5%, 1 Ohm DC Resistance (Digikey: 535-10506-2-ND) 1007 (2518 Metric) SMT: 10µH 10% 250mOhm 820mA 1007 Inductor (Digikey: 587-2189-1-ND) 22µH 10% 500mOhm 580mA 1007 Inductor (Digikey: 587-2190-1-ND) 47µH 10% 950mOhm 420mA 1007 Inductor (Digikey: 587-2191-1-ND) 47µH 5% 100mOhm 1A 1008 Inductor (Digikey: 732-1816-1-ND) 5.0x5.0mm (Taiyo Yuden NR5040 Series) 6.8µH 20% 2.3A 64mOhm Inductor (Digikey: 587-2374-2-ND) 5.0x5.0mm (TDK VLC5045 Series) 4.7µH 20% 3.3A 34mOhm Inductor (Digikey: 445-6526-1-ND) 6.8µH 20% 2.7A 46mOhm Inductor (Digikey: 445-6527-1-ND) 6.0x6.0mm (TDK VLC6045 Series) 4.7µH 20% 3.8A 27mOhm Inductor (Digikey: 445-6538-2-ND) 6.8µH 20% 3A 41mOhm Inductor (Digikey: 445-6540-1-ND) 6.2µH 30% 2.2A 45mOhm Inductor (Digikey: SRR5028-6R2YCT-ND) - Not TDK VLC6045 but footprint should match 6.0x6.0mm (TDK SLF6045 Series) 6.8uH 30% 2A 33mOhm Inductor (Digikey: 445-4572-1-ND, Mouser: 810-SLF645T6R8N2R0PF)
LED = tobias:LED-RGB-ANODE-3.5X2.8
Q1 = tobias:MOSFET-N
Q2 = tobias:MOSFET-P: SSM3J358R Toshiba
Q3 = tobias:MOSFET-N-DUAL: Dual N-Channel MOSFET SOT363 (2.0x1.25mm) 2N7002PS - 60V, 320mA [Digikey: 568-5984-1-ND]
R1-R31 = tobias:RESISTOR: Resistors 0402 - 0402 Surface Mount Package 22 Ohm 1% 1/16W [Digikey: 311-22.0LRTR-ND] 33 Ohm 5% 1/16W 1.0K 5% 1/16W 1.5K 5% 1/16W 2.0K 1% 1/16W 10.0K 1% 1/16W [Digikey: 311-10.0KLRTR-ND] 10.0K 5% 1/16W [Digikey: RMCF0402JT10K0TR-ND] 12.1K 1% 1/16W [Digikey: 311-22.0LRTR-ND] 100.0K 5% 1/16W 0603 - 0603 Surface Mount Package 0 Ohm 1/10 Watt 1% Resistor 15 Ohm 1/10 Watt 1% Resistor 33 Ohm 1/10 Watt 1% Resistor 49.9 Ohm 1/10 Watt 1% Resistor 100 Ohm 1/10 Watt 1% Resistor 150 Ohm 1/10 Watt 1% Resistor 240 Ohm 1/10 Watt 1% Resistor 390 Ohm 1/10 Watt 1% Resistor 560 Ohm 1/10 Watt 1% Resistor 680 Ohm 1/10 Watt 1% Resistor 750 Ohm 1/10 Watt 1% Resistor 1.0K Ohm 1/10 Watt 1% Resistor 1.5K Ohm 1/10 Watt 1% Resistor 2.0K Ohm 1/10 Watt 1% Resistor 2.2K Ohm 1/10 Watt 1% Resistor 3.3K Ohm 1/10 Watt 1% Resistor 4.7K Ohm 1/10 Watt 1% Resistor 10.0K Ohm 1/10 Watt 1% Resistor 12.0K Ohm 1/10 Watt 1% Resistor 12.1K Ohm 1/10 Watt 1% Resistor 20.0K Ohm 1/10 Watt 1% Resistor 33.0K Ohm 1/10 Watt 1% Resistor 100.0K Ohm 1/10 Watt 1% Resistor 0805 - 0805 Surface Mount Package 0 Ohm 1/8 Watt 1% Resistor 33 Ohm 1/8 Watt 1% Resistor 100 Ohm 1/8 Watt 1% Resistor 150 Ohm 1/8 Watt 1% Resistor 200 Ohm 1/8 Watt 1% Resistor 240 Ohm 1/8 Watt 1% Resistor 330 Ohm 1/8 Watt 1% Resistor 390 Ohm 1/8 Watt 1% Resistor 470 Ohm 1/8 Watt 1% Resistor 1.0K Ohm 1/8 Watt 1% Resistor 1.5K Ohm 1/8 Watt 1% Resistor 2.0K Ohm 1/8 Watt 1% Resistor 4.7K Ohm 1/8 Watt 1% Resistor 5.1K Ohm 1/8 Watt 1% Resistor 5.6K Ohm 1/8 Watt 1% Resistor 10.0K Ohm 1/8 Watt 1% Resistor 22.0K Ohm 1/8 Watt 1% Resistor 33.0K Ohm 1/8 Watt 1% Resistor 100K Ohm 1/8 Watt 1% Resistor 1206 - 1206 Surface Mount Package 2012 - 2010 Surface Mount Package 0.11 Ohm 1/2 Watt 1% Resistor - Digikey: RHM.11UCT-ND
RTC = SparkFun-Jumpers:JUMPER-SMT_2_NC_PASTE: Normally closed solder jumper This jumper has an aperture in the stencil to allow solder paste to bridge the split in the wire so it's normally closed (NC). Wick off the solder to open the connection. Reapply solder to reclose the connection.
T1 = tobias:DTC114YE
U1 = tobias:SC810
U2 = tobias:LSM6DSOX
U3 = tobias:BME280; PROD_ID: IC-13090
U4 = tobias:DG2525
U5 = Thread-USB-Key:CP2102N-20
U6 = tobias:TPS62A0XA
U7 = tobias:STM32U585-QFN48
U8 = tobias:PCA9534
U9 = tobias:VREG_SOT23-5: SOT23-5 Fixed Voltage Regulators To better organise some of the SOT23-5 fixed voltage regulators in this library, this new part was created. Part Current Out V Out V In V Dropout Digikey Part No. ADP121 150mA 3.3V 3.4-5.5V 0.09V @ 150mA ADP121-AUJZ33R7CT-ND ADP121 150mA 3.0V 3.1-5.5V 0.09V @ 150mA ADP121-AUJZ30R7CT-ND ADP122 300mA 3.3V 3.4-5.5V 0.085V @ 300mA ADP122AUJZ-3.3-R7CT-ND ADP1712 300mA 3.3V 3.5-5.5V 0.17V @ 300mA ADP1712AUJZ-3.3-R7TR-ND AP7311 (Low Cost) 150mA 3.3V 3.5-6V 0.15V @ 150mA AP7311-33WG-7DICT-ND LD39015M18R 150mA 1.8V 1.9V-5.5V 0.08V @ 100mA 497-6977-1-ND MCP1824T-3302E/OT 300mA 3.3V 3.5V-6V 0.2V @ 300mA MCP1824T-3302E/OTCT-ND MIC5205-2.5YM5 TR 150mA 2.5V 2.7-16V 0.165V @ 150mA 576-1257-2-ND MIC5205-3.0YM5 TR 150mA 3.0V 3.2V-16V 0.165V @ 150mA 576-1258-2-ND MIC5205-3.3YM5 TR 150mA 3.3V 3.5V-16V 0.165V @ 150mA 576-1259-2-ND TPS780330220 150mA 3.3V+2.2V 3.6-5.5V 250mV Max 296-23332-1-ND TDA3663/N1,135 100mA 3.3V 3.5-45V 0.18V @ 50mA 568-5343-1-ND
U10 = tobias:TXB0104
U11 = tobias:S1318
U12 = Cellular:HL781X
USB = tobias:USB-4110-CGT
X1 = tobias:ABS05-32.768KHZ: 32.768kHz Crystal; DIGIKEY: 535-11897-1-ND

## Net classes
1 highpower: width 0.305 mm, drill 0.483 mm
2 lowpower: width 0.254 mm, drill 0.483 mm